# EAGLE design 12 (EAGLE 6.5.0)
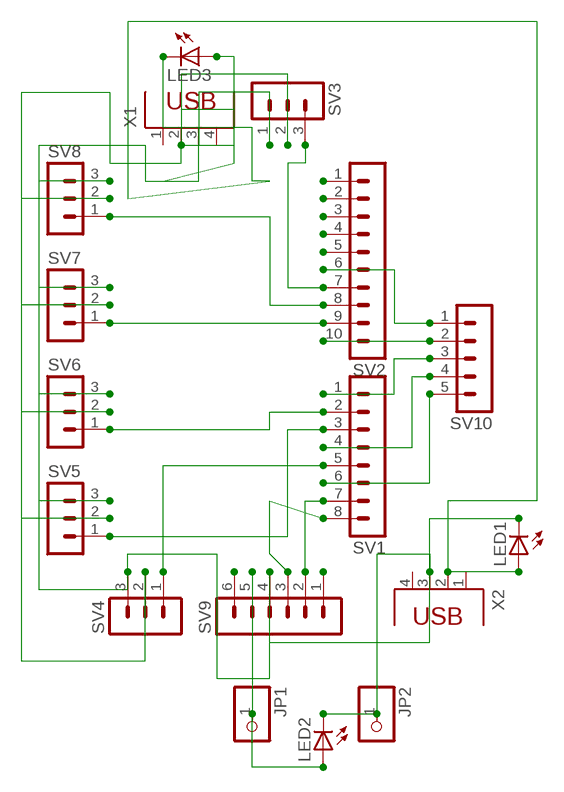
[diagram p0: schematic, sheet 1]

## Parts
JP1  PINHD-1X1  [1X01]
JP2  PINHD-1X1  [1X01]
LED1  LEDLD260  [LD260]
LED2  LEDLD260  [LD260]
LED3  LEDLD260  [LD260]
SV1  MA08-1  [MA08-1]
SV2  MA10-1  [MA10-1]
SV3  MA03-1  [MA03-1]
SV4  MA03-1  [MA03-1]
SV5  MA03-1  [MA03-1]
SV6  MA03-1  [MA03-1]
SV7  MA03-1  [MA03-1]
SV8  MA03-1  [MA03-1]
SV9  MA06-1  [MA06-1]
SV10  MA05-1  [MA05-1]
X1  PN61729  [PN61729]
X2  PN61729  [PN61729]

## Nets
N$1: SV2.7 SV3.3
N$5: JP1.1 LED2.A SV9.5
N$7: LED1.A LED3.A SV3.2 SV4.2 SV5.2 SV6.2 SV7.2 SV8.2 X1.2 X2.2
N$10: SV2.8 SV8.1
N$12: SV2.9 SV7.1
N$15: SV1.2 SV6.1
N$19: SV1.3 SV5.1
N$22: SV1.5 SV4.1
N$23: SV9.6
N$26: SV1.8 SV9.3
N$27: SV1.7 SV9.2
N$28: SV9.1
N$35: SV1.6 SV10.5
N$37: SV1.4 SV10.4
N$40: SV1.1 SV10.3
N$41: SV2.10 SV10.2
N$45: SV2.5
N$46: SV2.6 SV10.1
N$47: SV2.4
N$48: SV2.3
N$49: SV2.2
N$50: SV2.1
OMAR: JP2.1 LED1.K(C) LED2.K(C) LED3.K(C) SV3.1 SV4.3 SV5.3 SV6.3 SV7.3 SV8.3 SV9.4 X1.3 X2.3
Unconnected: X1.1 X1.4 X2.1 X2.4

## Library data of the parts
JP1 JP2 = pinhead:PINHD-1X1: PIN HEADER
LED1-LED3 = led:LED: LED OSRAM: - CHIPLED LG R971, LG N971, LY N971, LG Q971, LY Q971, LO R971, LY R971 LH N974, LH R974 LS Q976, LO Q976, LY Q976 LO Q996 - Hyper CHIPLED LW Q18S LB Q993, LB Q99A, LB R99A - SideLED LS A670, LO A670, LY A670, LG A670, LP A670 LB A673, LV A673, LT A673, LW A673 LH A674 LY A675 LS A676, LA A676, LO A676, LY A676, LW A676 LS A679, LY A679, LG A679 - Hyper Micro SIDELED® LS Y876, LA Y876, LO Y876, LY Y876 LT Y87S - SmartLED LW L88C, LW L88S LB L89C, LB L89S, LG L890 LS L89K, LO L89K, LY L89K LS L896, LA L896, LO L896, LY L896 - TOPLED LS T670, LO T670, LY T670, LG T670, LP T670 LSG T670, LSP T670, LSY T670, LOP T670, LYG T670 LG T671, LOG T671, LSG T671 LB T673, LV T673, LT T673, LW T673 LH T674 LS T676, LA T676, LO T676, LY T676, LB T676, LH T676, LSB T676, LW T676 LB T67C, LV T67C, LT T67C, LS T67K, LO T67K, LY T67K, LW E67C LS E67B, LA E67B, LO E67B, LY E67B, LB E67C, LV E67C, LT E67C LW T67C LS T679, LY T679, LG T679 LS T770, LO T770, LY T770, LG T770, LP T770 LB T773, LV T773, LT T773, LW T773 LH T774 LS E675, LA E675, LY E675, LS T675 LS T776, LA T776, LO T776, LY T776, LB T776 LHGB T686 LT T68C, LB T68C - Hyper Mini TOPLED® LB M676 - Mini TOPLED Santana® LG M470 LS M47K, LO M47K, LY M47K Source: http://www.osram.convergy.de LUXEON: - LUMILED® LXK2-PW12-R00, LXK2-PW12-S00, LXK2-PW14-U00, LXK2-PW14-V00 LXK2-PM12-R00, LXK2-PM12-S00, LXK2-PM14-U00 LXK2-PE12-Q00, LXK2-PE12-R00, LXK2-PE12-S00, LXK2-PE14-T00, LXK2-PE14-U00 LXK2-PB12-K00, LXK2-PB12-L00, LXK2-PB12-M00, LXK2-PB14-N00, LXK2-PB14-P00, LXK2-PB14-Q00 LXK2-PR12-L00, LXK2-PR12-M00, LXK2-PR14-Q00, LXK2-PR14-R00 LXK2-PD12-Q00, LXK2-PD12-R00, LXK2-PD12-S00 LXK2-PH12-R00, LXK2-PH12-S00 LXK2-PL12-P00, LXK2-PL12-Q00, LXK2-PL12-R00 Source: www.luxeon.com KINGBRIGHT: KA-3528ASYC Source: www.kingbright.com
SV1 = con-lstb:MA08-1: PIN HEADER; OC_FARNELL: unknown; OC_NEWARK: unknown
SV2 = con-lstb:MA10-1: PIN HEADER; OC_FARNELL: unknown; OC_NEWARK: unknown
SV3-SV8 = con-lstb:MA03-1: PIN HEADER; OC_FARNELL: unknown; OC_NEWARK: unknown
SV9 = con-lstb:MA06-1: PIN HEADER; OC_FARNELL: unknown; OC_NEWARK: unknown
SV10 = con-lstb:MA05-1: PIN HEADER; OC_FARNELL: unknown; OC_NEWARK: unknown
X1 X2 = con-berg:PN61729: BERG USB connector; OC_FARNELL: unknown; OC_NEWARK: unknown

## Board
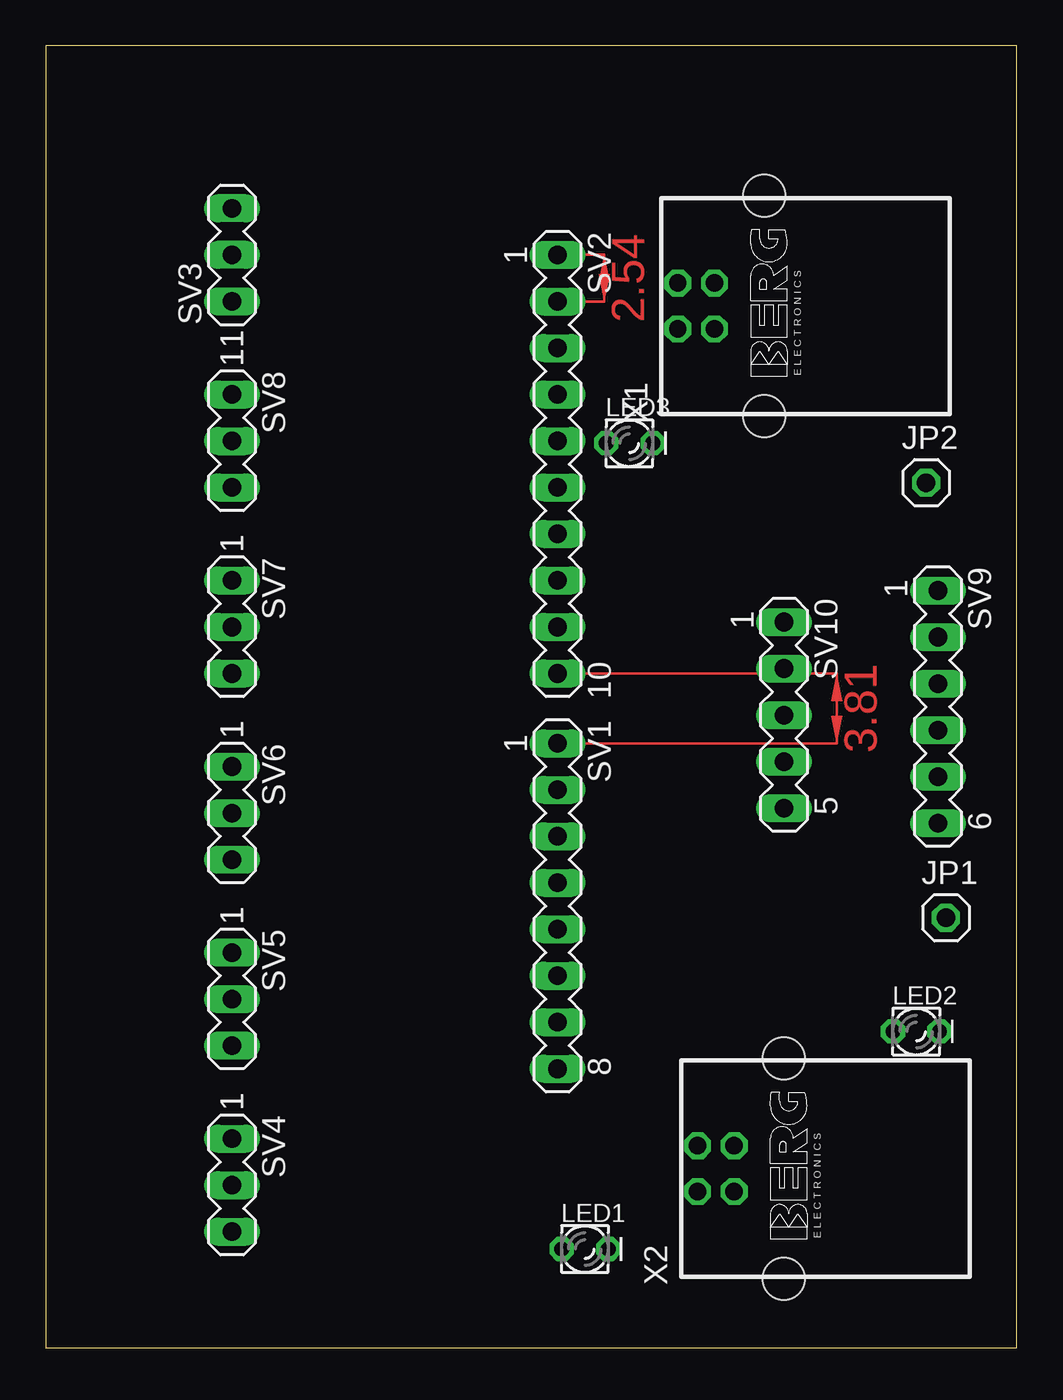
[diagram p1: board, top side]
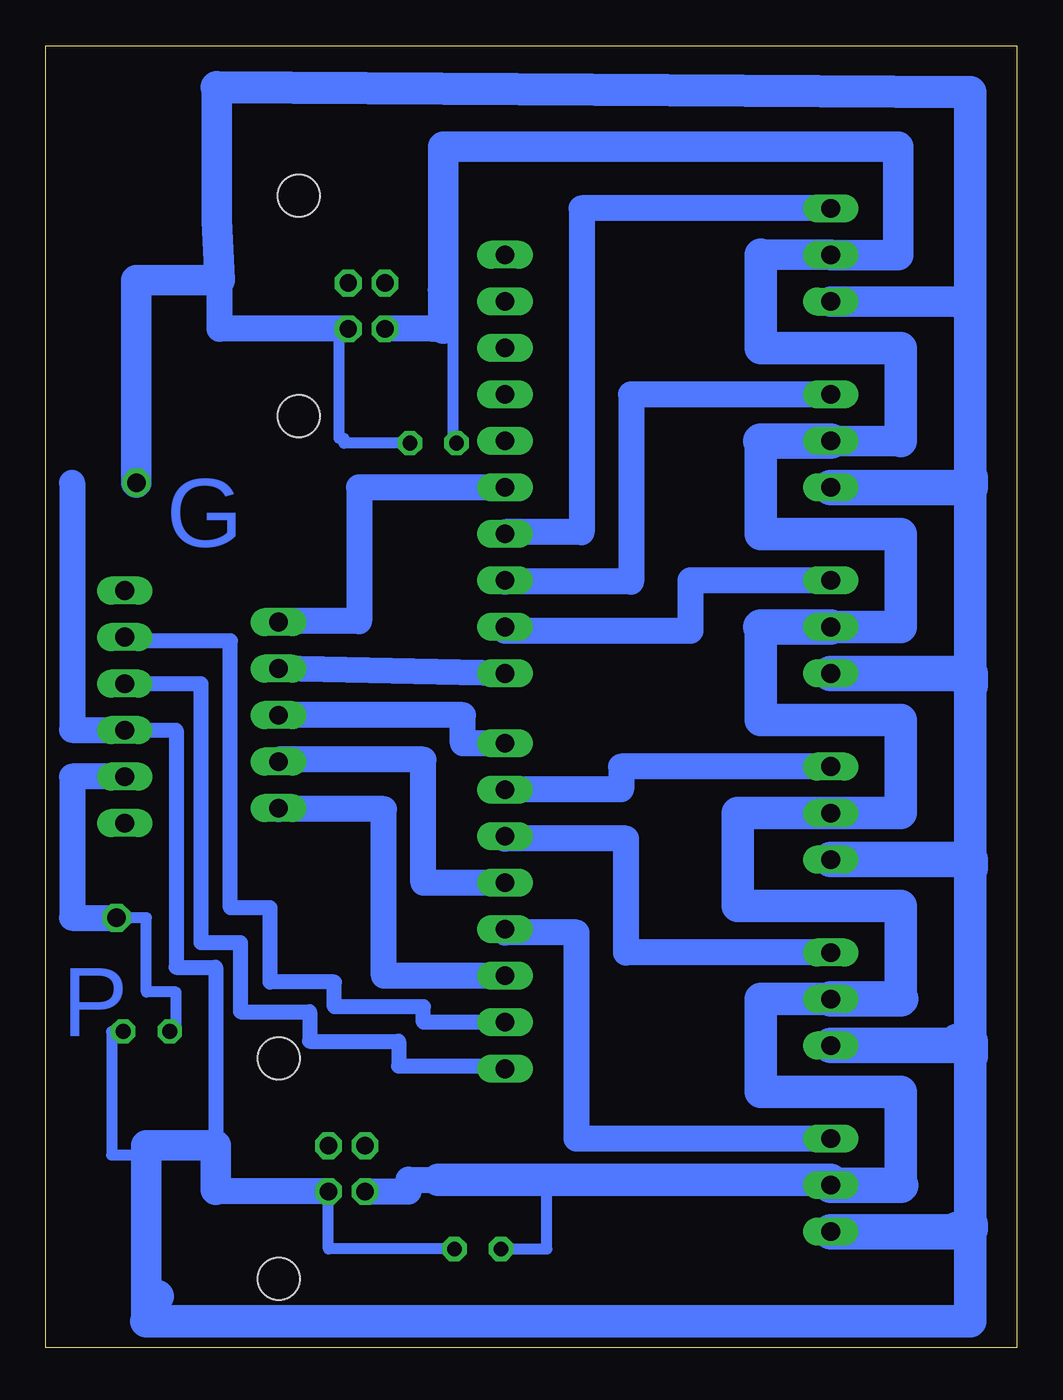
[diagram p2: board, bottom side, seen from below]

Size 53.01 x 71.11 mm. Coordinates in mm from the lower left corner, seen from the top.
Outline: 0,0 53.01,0 53.01,71.11 0,71.11 0,0
Copper layers (1*16): Top 0.035mm / dielectric 1.5mm / Bottom 0.035mm
Design rules "default": minimum track width 10mil, minimum drill 24mil, track to track 8mil, track to pad 8mil, pad to pad 8mil, via to via 8mil, smd to smd 8mil, copper to edge 40mil, drill to drill 8mil, minimum pad ring 10mil, minimum via ring 8mil, stop-mask expansion 4mil, vias tented up to drill 0mil, thermal gap 10mil

### Footprints (pad centres in the part's own frame; a part is rotated, then mirrored left to right if it is on the bottom)
1X01 = drill 1.016 octagon: 1 0,0
LD260 = drill 0.813 octagon: A -1.27,0; K 1.27,0
MA08-1 = drill 1.016 long: 1 -8.89,0; 2 -6.35,0; 3 -3.81,0; 4 -1.27,0; 5 1.27,0; 6 3.81,0; 7 6.35,0; 8 8.89,0
MA10-1 = drill 1.016 long: 1 -11.43,0; 2 -8.89,0; 3 -6.35,0; 4 -3.81,0; 5 -1.27,0; 6 1.27,0; 7 3.81,0; 8 6.35,0; 9 8.89,0; 10 11.43,0
MA03-1 = drill 1.016 long: 1 -2.54,0; 2 0,0; 3 2.54,0
MA06-1 = drill 1.016 long: 1 -6.35,0; 2 -3.81,0; 3 -1.27,0; 4 1.27,0; 5 3.81,0; 6 6.35,0
MA05-1 = drill 1.016 long: 1 -5.08,0; 2 -2.54,0; 3 0,0; 4 2.54,0; 5 5.08,0
PN61729 = drill 0.95 octagon: 1 1.25,4.71; 2 -1.25,4.71; 3 -1.25,2.71; 4 1.25,2.71 | hole 2.3: -6.02,0; 6.02,0

### Placement (x,y rotation side)
JP1  49.14,23.49 0 top
JP2  48.06,47.25 0 top
LED1  29.43,5.4 0 top
LED2  47.52,17.28 0 top
LED3  31.86,49.41 0 top
SV1  27.94,24.13 270 top
SV2  27.94,48.26 270 top
SV3  10.16,59.69 90 top
SV4  10.16,8.89 270 top
SV5  10.16,19.05 270 top
SV6  10.16,29.21 270 top
SV7  10.16,39.37 270 top
SV8  10.16,49.53 270 top
SV9  48.7,35.01 270 top
SV10  40.31,34.56 270 top
X1  39.21,56.9 90 top
X2  40.29,9.79 90 top

### Tracks (layer width: path | path; a pad name or v marks a point on that pad's centre or on a via)
N$1
  Bottom 1.422: SV3.3 23.76,62.23 23.76,44.55 27.94,44.55 SV2.7
N$5
  Bottom 0.61: LED2.A 45.9,17.28 45.9,19.44 47.52,19.44 47.52,23.49 JP1.1
  Bottom 1.422: SV9.5 51.57,31.2 51.57,23.49 JP1.1
N$7
  Bottom 0.61: LED1.A 25.65,5.4 25.65,9.18 | LED3.A 30.78,49.41 30.78,57.78 31.86,57.78 31.86,55.65
  Bottom 1.422: 31.32,55.65 31.86,55.65 X1.2 | X2.2 33.21,8.54 33.21,9.18 30.51,9.18
  Bottom 1.676: 13.97,59.69 SV3.2 10.16,59.67 6.48,59.67 6.48,65.61 31.32,65.61 31.32,55.65 | SV8.2 6.35,49.53
  Bottom 1.778: 6.35,49.53 6.35,54.61 13.97,54.61 13.97,59.69 | SV7.2 6.35,39.37 6.35,44.45 13.97,44.45 13.97,49.53 | 13.97,39.37 13.97,34.29 6.35,34.29 6.35,29.21 SV6.2 15.24,29.21 15.24,24.13 6.35,24.13 6.35,19.05 | 6.35,8.89 6.35,13.97 13.97,13.97 13.97,19.05 SV5.2 | 31.59,9.18 30.51,9.18 25.65,9.18 10.16,9.18 SV4.2
  Bottom 1.93: SV4.2 6.35,8.89 | SV5.2 6.35,19.05 | 13.97,39.37 SV7.2 | 13.97,49.53 SV8.2
N$10
  Bottom 1.422: SV8.1 21.06,52.07 21.06,41.85 27.94,41.85 SV2.8
N$12
  Bottom 1.422: SV7.1 17.82,41.91 17.82,39.15 27.94,39.15 SV2.9
N$15
  Bottom 1.422: SV6.1 21.6,31.75 21.6,30.51 27.94,30.51 SV1.2
N$19
  Bottom 1.422: SV5.1 21.33,21.59 21.33,27.81 27.94,27.81 SV1.3
N$22
  Bottom 1.422: SV4.1 24.03,11.43 24.03,22.68 27.94,22.68 SV1.5
N$26
  Bottom 0.813: SV9.3 44.55,36.28 44.55,22.14 42.39,22.14 42.39,18.36 38.61,18.36 38.61,16.74 33.75,16.74 33.75,15.39 27.94,15.39 SV1.8
N$27
  Bottom 0.813: SV1.7 32.4,17.78 32.4,18.63 37.26,18.63 37.26,19.98 40.77,19.98 40.77,24.03 42.93,24.03 42.93,38.61 48.7,38.61 SV9.2
N$35
  Bottom 1.422: SV1.6 34.56,20.32 34.56,29.43 40.31,29.43 SV10.5
N$37
  Bottom 1.422: SV1.4 32.4,25.4 32.4,32.13 40.31,32.13 SV10.4
N$40
  Bottom 1.422: SV1.1 30.24,33.02 30.24,34.56 SV10.3
N$41
  Bottom 1.422: SV2.10 SV10.2
N$46
  Bottom 1.422: SV2.6 35.91,46.99 35.91,39.69 40.31,39.69 SV10.1
OMAR
  Bottom 0.61: LED2.K 49.41,17.28 49.41,10.53 47.52,10.53 | LED1.K 37.58,5.4 X2.3 | LED3.K 36.72,49.41 36.72,49.68 36.99,49.68 36.99,55.65
  Bottom 0.813: SV9.4 45.9,33.74 45.9,20.79 43.74,20.79 43.74,11.07
  Bottom 1.422: 51.57,47.25 51.57,33.75 SV9.4 | X1.3 36.99,55.65 43.52,55.65 43.52,58.32 | X2.3 43.74,8.54 43.74,8.64
  Bottom 1.676: 43.67,68.85 43.67,61.56 43.52,58.32 48.06,58.32 JP2.1 | 2.54,57.15 2.54,56.97 2.97,56.97 2.97,57.15 SV3.1 | 47.52,1.46 47.52,10.53 47.52,11.07 43.74,11.07 43.74,8.64
  Bottom 1.778: 2.54,47.52 2.54,56.97 2.54,68.58 43.67,68.85 | 2.54,46.99 2.54,36.18 2.54,26.19 2.54,15.93 2.54,6.75 2.54,1.46 47.52,1.46 46.91,2.81
  Bottom 1.93: SV8.3 2.54,46.99 2.54,47.52 | SV7.3 2.54,36.83 2.54,36.18 | SV6.3 2.54,26.67 2.54,26.19 | SV5.3 3.24,16.51 3.24,16.74 2.54,16.74 2.54,15.93 | SV4.3 3.24,6.35 3.24,6.48 2.54,6.48 2.54,6.75
(copper drawn outside any net)
  shapes: Top area x2

### Text on the board
Bottom: G | P